# Altium schematic sheet SCH-00001-A-01.SchDoc
size A4; SheetNumber: 1; SheetTotal: 4
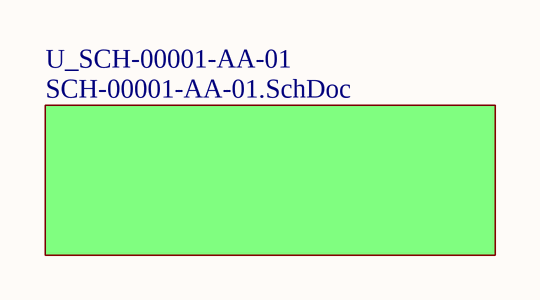
[diagram p0: SCH-00001-A-01.SchDoc]

## Sub-sheets
U_SCH-00001-AA-01 = SCH-00001-AA-01.SchDoc: no entries